# Altium schematic sheet TS.SchDoc
size A3
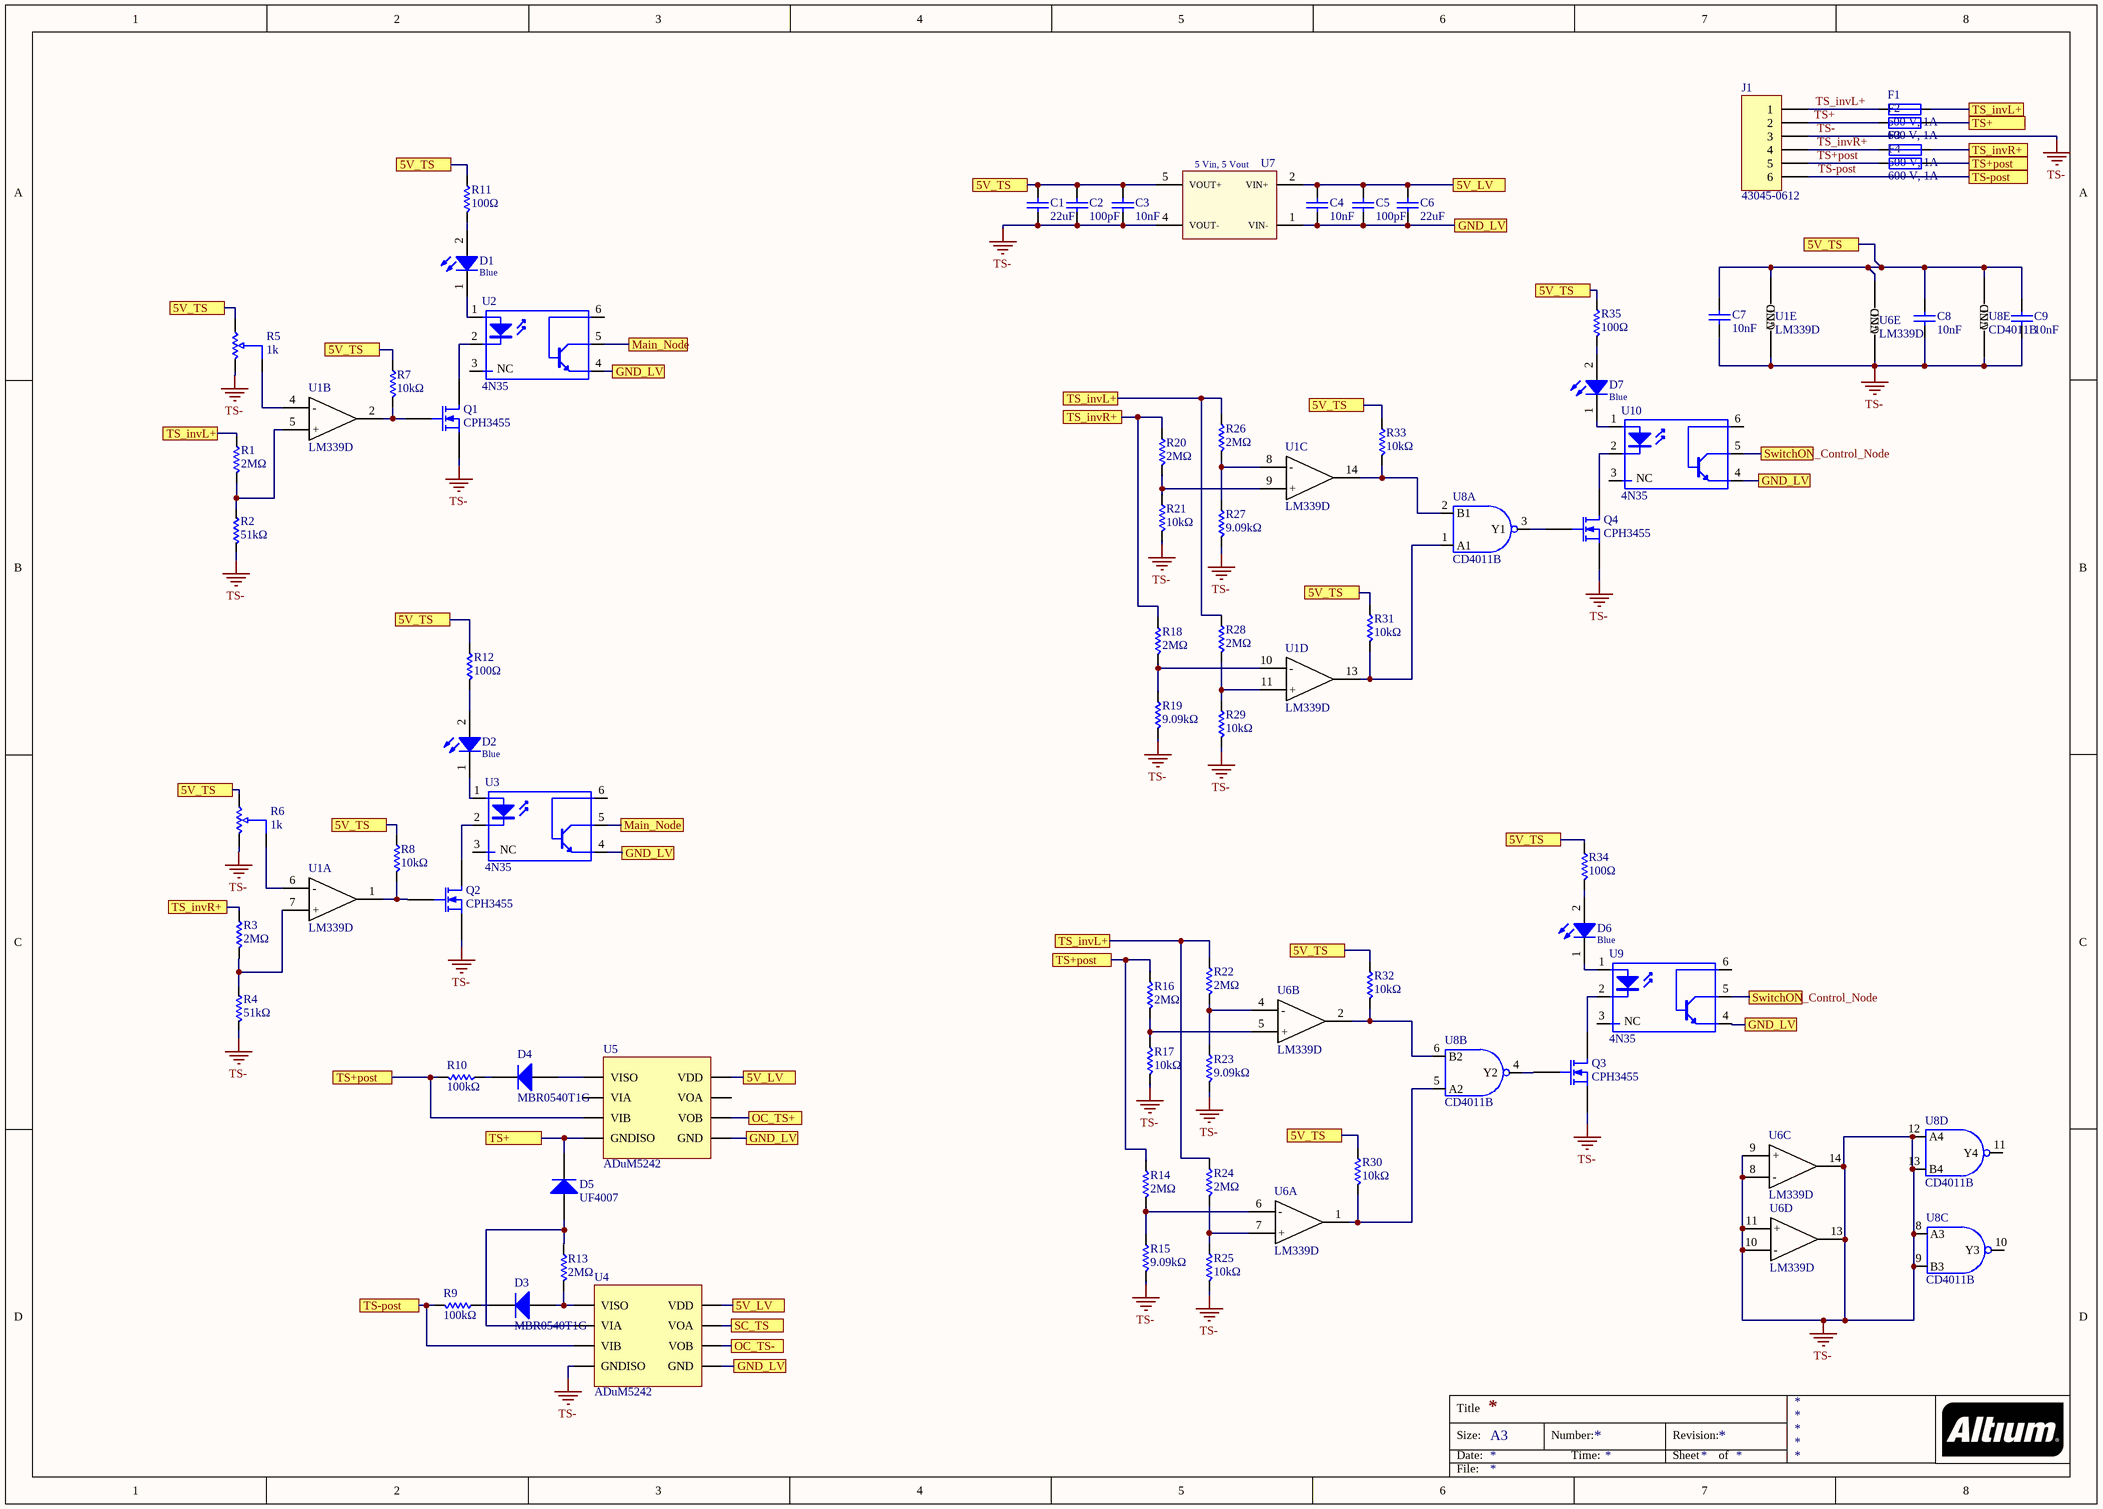
[diagram p0: TS.SchDoc]

## Parts
C1  22uF  [0805_2x1.25x1.25mm_Reflow Soldering]
C2  100pF  [0805_2x1.25x0.6mm_Reflow Soldering]
C3  10nF  [0805_2x1.25x0.8mm_Reflow Soldering]
C4  10nF  [0805_2x1.25x0.8mm_Reflow Soldering]
C5  100pF  [0805_2x1.25x0.6mm_Reflow Soldering]
C6  22uF  [0805_2x1.25x1.25mm_Reflow Soldering]
C7  10nF  [0805_2x1.25x0.8mm_Reflow Soldering]
C8  10nF  [0805_2x1.25x0.8mm_Reflow Soldering]
C9  10nF  [0805_2x1.25x0.8mm_Reflow Soldering]
D1  Blue  [WL-SMCW_0805]
D2  Blue  [WL-SMCW_0805]
D3  MBR0540T1G  [MBR0540T1G]
D4  MBR0540T1G  [MBR0540T1G]
D5  UF4007  [UF4007]
D6  Blue  [WL-SMCW_0805]
D7  Blue  [WL-SMCW_0805]
F1  600 V, 1A  [485001]
F2  600 V, 1A  [485001]
F3  600 V, 1A  [485001]
F4  600 V, 1A  [485001]
J1  43045-0612  [43045-0612]
Q1  CPH3455  [CPH3455]
Q2  CPH3455  [CPH3455]
Q3  CPH3455  [CPH3455]
Q4  CPH3455  [CPH3455]
R1  2MΩ  [CRMA2512]
R2  51kΩ  [1206]
R3  2MΩ  [CRMA2512]
R4  51kΩ  [1206]
R5  1k  [3296Y-1-102LF]
R6  1k  [3296Y-1-102LF]
R7  10kΩ  [CR0805]
R8  10kΩ  [CR0805]
R9  100kΩ  [1206]
R10  100kΩ  [1206]
R11  100Ω  [CR0805]
R12  100Ω  [CR0805]
R13  2MΩ  [CRMA2512]
R14  2MΩ  [CRMA2512]
R15  9.09kΩ  [1206]
R16  2MΩ  [CRMA2512]
R17  10kΩ  [1206]
R18  2MΩ  [CRMA2512]
R19  9.09kΩ  [1206]
R20  2MΩ  [CRMA2512]
R21  10kΩ  [1206]
R22  2MΩ  [CRMA2512]
R23  9.09kΩ  [1206]
R24  2MΩ  [CRMA2512]
R25  10kΩ  [1206]
R26  2MΩ  [CRMA2512]
R27  9.09kΩ  [1206]
R28  2MΩ  [CRMA2512]
R29  10kΩ  [1206]
R30  10kΩ  [CR0805]
R31  10kΩ  [CR0805]
R32  10kΩ  [CR0805]
R33  10kΩ  [CR0805]
R34  100Ω  [CR0805]
R35  100Ω  [CR0805]
U1  LM339D  [LM339D]  (parts A,B,C,D,E of 5)
U2  4N35  [4N35]
U3  4N35  [4N35]
U4  ADuM5242  [ADuM5242]
U5  ADuM5242  [ADuM5242]
U6  LM339D  [LM339D]  (parts A,B,C,D,E of 5)
U7  5 Vin, 5 Vout  [MagI³C-FISM_SMT-8]
U8  CD4011B  [CD4011BM]  (parts A,B,C,D,E of 5)
U9  4N35  [4N35]
U10  4N35  [4N35]

## Ports
5V_LV, 5V_TS, GND_LV, Main_Node, OC_TS+, OC_TS-, SC_TS, SwitchON_Control_Node, TS+, TS+post, TS-post, TS_invL+, TS_invR+

## Nets
TS-: C1.1 C2.1 C3.1 C7.1 C8.1 C9.1 J1.3 Q1.3(S) Q2.3(S) Q3.3(S) Q4.3(S) R2.1 R4.1 R5.3 R6.3 R15.1 R17.1 R19.1 R21.1 R23.1 R25.1 R27.1 R29.1 U1.12(GND) U4.5(GNDISO) U6.8(-) U6.9(+) U6.10(-) U6.11(+) U6.12(GND) U6.13(4OUT) U6.14(3OUT) U7.4(VOUT-) U8.7(GND) U8.8(A3) U8.9(B3) U8.12(A4) U8.13(B4)
5V_LV: C4.2 C5.2 C6.2 U4.1(VDD) U5.1(VDD) U7.2(VIN+) ; port 5V_LV
5V_TS: C1.2 C2.2 C3.2 C7.2 C8.2 C9.2 R5.1 R6.1 R7.2 R8.2 R11.2 R12.2 R30.2 R31.2 R32.2 R33.2 R34.2 R35.2 U1.3(VCC) U6.3(VCC) U7.5(VOUT+) U8.14(VCC) ; port 5V_TS
GND_LV: C4.1 C5.1 C6.1 U2.4(E) U3.4(E) U4.4(GND) U5.4(GND) U7.1(VIN-) U9.4(E) U10.4(E) ; port GND_LV
Main_Node: U2.5(C) U3.5(C) ; port Main_Node
OC_TS+: U5.3(VOB) ; port OC_TS+
OC_TS-: U4.3(VOB) ; port OC_TS-
SC_TS: U4.2(VOA) ; port SC_TS
SwitchON_Control_Node: U9.5(C) U10.5(C) ; port SwitchON_Control_Node
TS+: D5.1(K) F2.2 U5.5(GNDISO) ; port TS+
TS+: F2.1 J1.2  [a separate net that carries the same name]
TS+post: F4.2 R10.1 R14.2 R16.2 U5.6(VIB) ; port TS+post
TS+post: F4.1 J1.5  [a separate net that carries the same name]
TS-post: J1.6 R9.1 U4.6(VIB) ; port TS-post
TS_invL+: F1.2 R1.2 R22.2 R24.2 R26.2 R28.2 ; port TS_invL+
TS_invL+: F1.1 J1.1  [a separate net that carries the same name]
TS_invR+: F3.2 R3.2 R18.2 R20.2 ; port TS_invR+
TS_invR+: F3.1 J1.4  [a separate net that carries the same name]
NetD1_1: D1.1(K) U2.1(A)
NetD1_2: D1.2(A) R11.1
NetD2_1: D2.1(K) U3.1(A)
NetD2_2: D2.2(A) R12.1
NetD3_1: D3.1(K) R9.2
NetD3_2: D3.2(A) R13.1 U4.8(VISO)
NetD4_1: D4.1(K) R10.2
NetD4_2: D4.2(A) U5.8(VISO)
NetD5_2: D5.2(A) R13.2 U4.7(VIA)
NetD6_1: D6.1(K) U9.1(A)
NetD6_2: D6.2(A) R34.1
NetD7_1: D7.1(K) U10.1(A)
NetD7_2: D7.2(A) R35.1
NetQ1_1: Q1.1(G) R7.1 U1.2(2OUT)
NetQ1_2: Q1.2(D) U2.2(K)
NetQ2_1: Q2.1(G) R8.1 U1.1(1OUT)
NetQ2_2: Q2.2(D) U3.2(K)
NetQ3_1: Q3.1(G) U8.4(Y2)
NetQ3_2: Q3.2(D) U9.2(K)
NetQ4_1: Q4.1(G) U8.3(Y1)
NetQ4_2: Q4.2(D) U10.2(K)
NetR1_1: R1.1 R2.2 U1.5(+)
NetR3_1: R3.1 R4.2 U1.7(+)
NetR5_2: R5.2 U1.4(-)
NetR6_2: R6.2 U1.6(-)
NetR14_1: R14.1 R15.2 U6.6(-)
NetR16_1: R16.1 R17.2 U6.5(+)
NetR18_1: R18.1 R19.2 U1.10(-)
NetR20_1: R20.1 R21.2 U1.9(+)
NetR22_1: R22.1 R23.2 U6.4(-)
NetR24_1: R24.1 R25.2 U6.7(+)
NetR26_1: R26.1 R27.2 U1.8(-)
NetR28_1: R28.1 R29.2 U1.11(+)
NetR30_1: R30.1 U6.1(1OUT) U8.5(A2)
NetR31_1: R31.1 U1.13(4OUT) U8.1(A1)
NetR32_1: R32.1 U6.2(2OUT) U8.6(B2)
NetR33_1: R33.1 U1.14(3OUT) U8.2(B1)

Not connected (* = marked no-connect by the designer): U2 3 6; U3 3 6; U5 2(VOA) 7(VIA); U8 10(Y3) 11(Y4); U9 3 6; U10 3 6

## Notes on the sheet
- Title
- Size:
- Date:
- A3
- Number:
- Time:
- Revision:
- Sheet
- of
- File:
- (in symbol 4N35) NC

## Library data of the parts
C1 C6 = 885012107011: WCAP-CSGP Ceramic Capacitors, 0805, X5R, 10V, 22uF; Rated Voltage: 10V DC; ComponentLink1Description: Manufacturer; ComponentLink1URL: http://www.we-online.de; ComponentLink2Description: Datasheet; ComponentLink2URL: http://katalog.we-online.de/pbs/datasheet/885012107011.pdf; Part Number: 885012107011; Published Date: Oct. 2017; Publisher: Wurth Elektronik; Size: 0805; Operating Temperature: -55 °C to +125 °C; Value: 22uF; Ceramic Type: X5R
C2 C5 = 885012007057: WCAP-CSGP Ceramic Capacitors, 0805, NP0, 50V, 100pF; Rated Voltage: 50V DC; ComponentLink1Description: Manufacturer; ComponentLink1URL: http://www.we-online.de; ComponentLink2Description: Datasheet; ComponentLink2URL: http://katalog.we-online.de/pbs/datasheet/885012007057.pdf; Part Number: 885012007057; Published Date: Oct. 2017; Publisher: Wurth Elektronik; Size: 0805; Operating Temperature: -55 °C to +125 °C; Value: 100pF; Ceramic Type: NP0
C3 C4 C7-C9 = 885012207092: WCAP-CSGP Ceramic Capacitors, 0805, X7R, 50V, 10nF; Rated Voltage: 50V DC; ComponentLink1Description: Manufacturer; ComponentLink1URL: http://www.we-online.de; ComponentLink2Description: Datasheet; ComponentLink2URL: http://katalog.we-online.de/pbs/datasheet/885012207092.pdf; Part Number: 885012207092; Published Date: Oct. 2017; Publisher: Wurth Elektronik; Size: 0805; Operating Temperature: -55 °C to +125 °C; Value: 10nF; Ceramic Type: X7R
D1 D2 D6 D7 = 150080BS75000: SMT Mono-color Chip LED Waterclear WL-SMCW, size 0805, Blue, 3.2 V, 140 deg, 145 mcd; Forward Voltage: 3.2 V; Viewing Angle: 140 deg; Peak Wavelength: 465 nm; Dominant Wavelength: 470 nm; Luminous Intensity: 145 mcd; Chip Technology: InGaN; ComponentLink1Description: Manufacturer; ComponentLink1URL: http://www.we-online.de; ComponentLink2Description: Datasheet; ComponentLink2URL: https://katalog.we-online.de/led/datasheet/150080BS75000.pdf; Part Number: 150080BS75000; Published Date: November 2018; Publisher: Wurth Elektronik; Size: 0805; Operating Temperature: -40 to 85 degC; Emitting Color: Blue; Mounting Technology: SMT; Packaging: Tape and Reel
D3 D4 = MBR0540T1G: Surface Mount / Schottky Power Rectifier; Manufacturer: ON Semiconductor; ComponentLink1Description: Datasheet; ComponentLink1URL: https://www.onsemi.com/pub/Collateral/MBR0540T1-D.PDF
D5 = UF4007: Ultrafast Plastic Rectifier; Manufacturer: Vishay; ComponentLink1Description: Datasheet; ComponentLink1URL: https://www.vishay.com/docs/88755/uf4001.pdf
F1-F4 = 485001: 485 Series Fuse; Manufacturer: Littlefuse; ComponentLink1Description: Datasheet; ComponentLink1URL: https://www.littelfuse.com/~/media/electronics/datasheets/fuses/littelfuse_fuse_485_datasheet.pdf.pdf; ComponentLink2Description: Manufacturer; ComponentLink2URL: https://www.littelfuse.com/
J1 = 43045-0612: Micro-Fit Vertical Header, Through Hole, 3mm Pitch, Dual Row, 6 Circuits; Manufacturer: Molex; Rated Voltage: 600V DC; Rated Current: 8.5A; Operating Temperature: -40ºC to +105ºC; ComponentLink1Description: Manufacturer; ComponentLink1URL: https://www.molex.com/molex/home; ComponentLink2Description: Datasheet; ComponentLink2URL: https://www.molex.com/pdm_docs/sd/430450612_sd.pdf
Q1-Q4 = CPH3455: Power MOSFET, 35V, 104 mohm, 3A, Single N-Channel; Manufacturer: ON Semiconductor; ComponentLink1Description: Datasheet; ComponentLink1URL: https://www.onsemi.com/pub/Collateral/CPH3455-D.PDF
R1 R3 R13 R14 R16 R18 R20 R22 R24 R26 R28 = CRMA2512AF2M00FKEF: Chip Resistor 2512, 1415V; Manufacturer: Vishay; ComponentLink1Description: Datasheet; ComponentLink1URL: https://www.mouser.es/datasheet/2/427/crma-1152212.pdf
R2 R4 = ERJP08F5102V: Chip Resistor 1206; Manufacturer: Panasonic; ComponentLink1Description: Datasheet; ComponentLink1URL: https://docs-emea.rs-online.com/webdocs/12cb/0900766b812cb812.pdf
R5 R6 = 3296Y-1-102LF: Potentiometer. 1/2W, 1k; Manufacturer: Bourns; ComponentLink1Description: Datasheet; ComponentLink1URL: https://docs-emea.rs-online.com/webdocs/069c/0900766b8069ccf4.pdf
R7 R8 R30-R33 = CR0805-JW-103ELF: Chip Resistor 0805; Manufacturer: Bourns; ComponentLink1Description: Datasheet; ComponentLink1URL: https://www.bourns.com/docs/product-datasheets/chpreztr.pdf?sfvrsn=566c91f1_11
R9 R10 = CR1206-FX-1003ELF: Chip Resistor 1206; Manufacturer: Bourns; ComponentLink1Description: Datasheet; ComponentLink1URL: https://docs-emea.rs-online.com/webdocs/1273/0900766b812730af.pdf
R11 R12 R34 R35 = CR0805-FX-1000ELF: Chip Resistor 0805; Manufacturer: Bourns; ComponentLink1Description: Datasheet; ComponentLink1URL: https://www.bourns.com/docs/product-datasheets/chpreztr.pdf?sfvrsn=566c91f1_11
R15 R19 R23 R27 = CRCW12069K09FKEA: Chip Resistor 1206; Manufacturer: Vishay; ComponentLink1Description: Datasheet; ComponentLink1URL: https://docs-emea.rs-online.com/webdocs/0d98/0900766b80d98b5e.pdf
R17 R21 R25 R29 = CR1206-JW-103GLF: Chip Resistor 1206; Manufacturer: Bourns; ComponentLink1Description: Datasheet; ComponentLink1URL: https://docs-emea.rs-online.com/webdocs/13ed/0900766b813ed02b.pdf
U1 U6 = LM339D: Quad Differential Comparators; Manufacturer: Texas Intstruments; ComponentLink1Description: Datasheet; ComponentLink1URL: http://www.ti.com/lit/ds/symlink/lm339.pdf
U2 U3 U9 U10 = 4N35: General Purpose 6-Pin Phototransistor Optocouplers; Manufacturer: ON Semiconductor/Fairchild; ComponentLink1Description: Datasheet; ComponentLink1URL: https://docs-emea.rs-online.com/webdocs/12cf/0900766b812cf004.pdf
U4 U5 = ADuM5242: Dual-Channel Isolator with isoPower Integrated DC-to-DC Converter; Manufacturer: Analog Devices; ComponentLink1Description: Datasheet; ComponentLink1URL: https://www.analog.com/media/en/technical-documentation/data-sheets/adum5240_5241_5242.pdf
U7 = 176920512: MagI³C-FISM Fixed Isolated Module, SMT-8, 5 Vin, 5 Vout; Output Voltage: 5 V; Output Power: 1 W; ComponentLink1Description: Manufacturer; ComponentLink1URL: http://www.we-online.de; ComponentLink2Description: Datasheet; ComponentLink2URL: https://katalog.we-online.de/pm/datasheet/176920512.pdf; Part Number: 176920512; Published Date: August 2018; Publisher: Wurth Elektronik; Size: SMT-8; Input Voltage: 5 V; Mounting Technology: SMT; Operating Temperature: -40 to 100 degC; Packaging: Tape and Reel
U8 = CD4011B: QUAD CMOS NAND GATES; Manufacturer: Texas Instruments; ComponentLink1Description: Datasheet; ComponentLink1URL: http://www.ti.com/lit/gpn/cd4011b